# EAGLE design shutter (EAGLE 7.5.0)
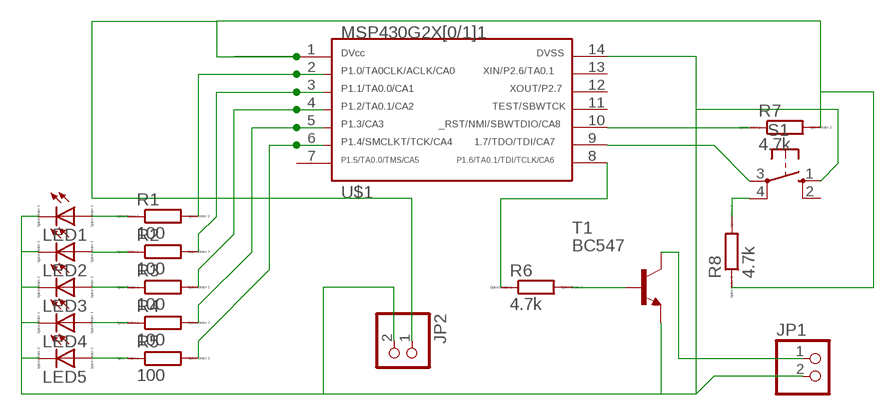
[diagram p0: schematic, sheet 1]

## Parts
JP1  PINHD-1X2  [1X02]
JP2  PINHD-1X2  [1X02]
LED1  LED_ESML0603  [LED_SML0603]
LED2  LED_ESML0603  [LED_SML0603]
LED3  LED_ESML0603  [LED_SML0603]
LED4  LED_ESML0603  [LED_SML0603]
LED5  LED_ESML0603  [LED_SML0603]
R1  100  RR0603  [R0603]
R2  100  RR0603  [R0603]
R3  100  RR0603  [R0603]
R4  100  RR0603  [R0603]
R5  100  RR0603  [R0603]
R6  4.7k  RR0603  [R0603]
R7  4.7k  RR0603  [R0603]
R8  4.7k  RR0603  [R0603]
S1  10-XX  [B3F-10XX]
T1  BC547  [TO92]
U$1  G2X[0/1]1---PW14  [PW14]

## Nets
GND: JP1.2 JP2.2 LED1.C LED2.C LED3.C LED4.C LED5.C S1.1(S) T1.1(E) U$1.14
N$2: R7.1 U$1.10
N$3: JP2.1 R7.2 R8.1 U$1.1
N$4: R6.2 T1.2(B)
N$5: LED1.A R1.1
N$6: LED2.A R2.1
N$7: LED3.A R3.1
N$8: LED4.A R4.1
N$9: LED5.A R5.1
N$10: R1.2 U$1.2
N$11: R2.2 U$1.3
N$12: R3.2 U$1.4
N$13: R4.2 U$1.5
N$14: R5.2 U$1.6
N$15: R6.1 U$1.8
N$16: S1.3(P) U$1.9
N$17: R8.2 S1.4(P1)
N$20: JP1.1 T1.3(C)
Unconnected: S1.2(S1) U$1.7 U$1.11 U$1.12 U$1.13

## Library data of the parts
JP1 JP2 = pinhead:PINHD-1X2: PIN HEADER
LED1-LED5 = eagle-ltspice:LED_E: LED Source: http://www.osram.convergy.de Source: www.luxeon.com Source: www.kingbright.com; SPICEMODEL: NONE; SPICEPREFIX: D; SPICETYPE: diode
R1-R8 = eagle-ltspice:R: RESISTOR, European symbol; SPICEMODEL: NONE; SPICEPREFIX: R
S1 = switch-omron:10-XX: OMRON SWITCH; MPN: B3F-1000; OC_FARNELL: 176432; OC_NEWARK: 36M3542
T1 = transistor:BC547: NPN TRANSISTOR
U$1 = TI_MSP430_v16:G2X[0/1]1---PW14: MSP430G2X[0/1]1 MSP430G2001, MSP430G2101, MSP430G2201,MSP430G2111, G2211 TSSOP (PW) 14 Pin Package http://focus.ti.com/docs/prod/folders/print/msp430g2111.html

## Board
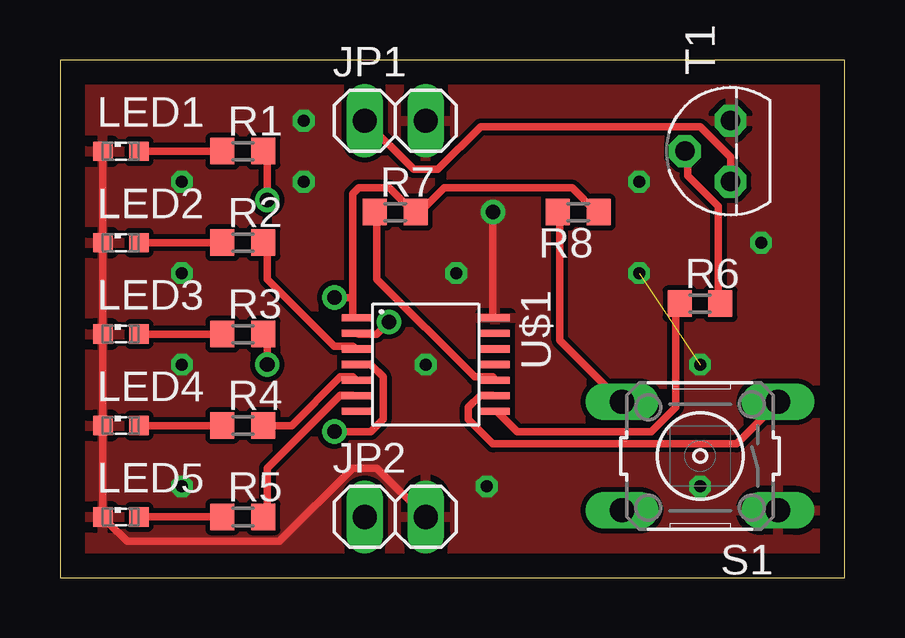
[diagram p1: board, top side]
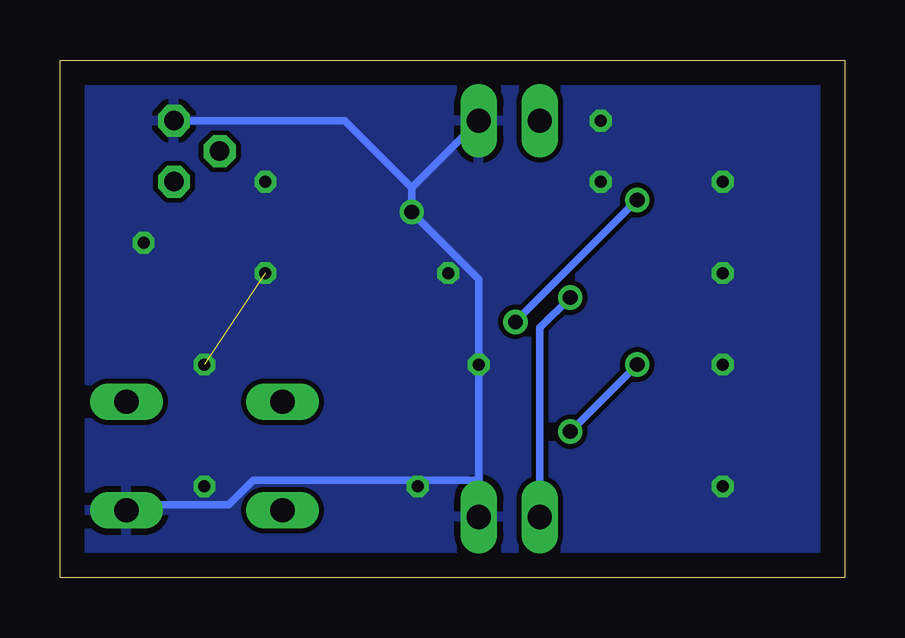
[diagram p2: board, bottom side, seen from below]

Size 32.69 x 21.58 mm. Coordinates in mm from the lower left corner, seen from the top.
Outline: 0,0 32.69,0 32.69,21.58 0,21.58 0,0
Copper layers (1*16): Top 0.035mm / dielectric 1.5mm / Bottom 0.035mm
Design rules "default *": minimum track width 12mil, minimum drill 24mil, track to track 8mil, track to pad 8mil, pad to pad 8mil, via to via 8mil, smd to smd 8mil, copper to edge 40mil, drill to drill 8mil, minimum pad ring 10mil, minimum via ring 8mil, stop-mask expansion 4mil, vias tented up to drill 0mil, thermal gap 10mil

### Footprints (pad centres in the part's own frame; a part is rotated, then mirrored left to right if it is on the bottom)
1X02 = drill 1.016 long: 1 -1.27,0; 2 1.27,0
LED_SML0603 = smd 0.8 x 0.8: A 0.75,0; C -0.75,0
R0603 = smd 1 x 1.1: 1 -0.85,0; 2 0.85,0
B3F-10XX = drill 1.016 long: 1 -3.251,2.261; 2 3.251,2.261; 3 -3.251,-2.261; 4 3.251,-2.261
TO92 = drill 0.813 octagon: 1 1.27,0; 2 0,1.905; 3 -1.27,0
PW14 = smd 0.3 x 1.2: 1 -1.95,-2.9; 2 -1.3,-2.9; 3 -0.65,-2.9; 4 0,-2.9; 5 0.65,-2.9; 6 1.3,-2.9; 7 1.95,-2.9; 8 1.95,2.9; 9 1.3,2.9; 10 0.65,2.9; 11 0,2.9; 12 -0.65,2.9; 13 -1.3,2.9; 14 -1.95,2.9

### Placement (x,y rotation side)
JP1  13.97,19.05 0 top
JP2  13.97,2.54 0 top
LED1  2.54,17.78 0 top
LED2  2.54,13.97 0 top
LED3  2.54,10.16 0 top
LED4  2.54,6.35 0 top
LED5  2.54,2.54 0 top
R1  7.62,17.78 0 top
R2  7.62,13.97 0 top
R3  7.62,10.16 0 top
R4  7.62,6.35 0 top
R5  7.62,2.54 0 top
R6  26.67,11.43 0 top
R7  13.97,15.24 0 top
R8  21.59,15.24 180 top
S1  26.67,5.08 180 top
T1  27.94,17.78 90 top
U$1  15.24,8.89 270 top

### Tracks (layer width: path | path; a pad name or v marks a point on that pad's centre or on a via)
GND  (via drill 0.5 pad 0.3, 0.61)  (1 unrouted)
  Top 0.305: 1.78,6.35 1.78,2.54 LED5.C 2.03,2.54 2.03,2.29 2.79,1.52 9.14,1.52 12.19,4.57 13.21,4.57 JP2.2 | 1.78,13.97 1.78,10.16 | 1.78,13.97 1.78,17.78 LED1.C | 1.78,13.97 LED2.C | 1.78,10.16 1.78,6.35 | 1.78,6.35 LED4.C | 1.78,10.16 LED3.C | v18.03,15.24 18.03,10.92 U$1.14
  Bottom 0.305: 18.03,16.26 v18.03,15.24 15.24,12.45 v15.24,8.89 15.24,4.06 | JP1.2 18.03,16.26 | T1.1 20.83,19.05 18.03,16.26 | 15.24,4.06 JP2.2 | 15.24,4.06 24.64,4.06 25.65,3.05 29.72,3.05 S1.1
  other vias: 24.13,16.51 5.08,16.51 5.08,12.7 5.08,8.89 5.08,3.81 10.16,16.51 10.16,19.05 16.51,12.7 24.13,12.7 29.21,13.97 17.78,3.81 26.67,3.81 26.67,8.89
  pour Bottom: 1.27,21.59 0,20.32 0,1.27 1.27,0 31.75,0 33.02,1.27 33.02,20.32 31.75,21.59
  pour Top: 1.27,21.59 0,20.32 0,1.27 1.27,0 31.75,0 33.02,1.27 33.02,20.32 31.75,21.59
N$2
  Top 0.305: R7.1 13.21,15.24 13.21,12.45 17.27,8.38 18.03,8.38 U$1.10
N$3  (via drill 0.61)
  Top 0.305: 12.19,11.68 12.19,10.92 U$1.1 | 12.19,11.68 12.19,16 12.45,16.26 13.72,16.26 14.73,15.24 R7.2 14.99,15.24 16,16.26 21.34,16.26 22.35,15.24 R8.1 | 12.19,11.68 v11.43,11.68
  Bottom 0.305: JP2.1 12.7,10.41 v11.43,11.68
N$4
  Top 0.305: R6.2 27.43,11.43 27.43,15.49 26.16,16.76 26.16,17.78 T1.2
N$5
  Top 0.305: R1.1 LED1.A
N$6
  Top 0.305: R2.1 LED2.A
N$7
  Top 0.305: R3.1 LED3.A
N$8
  Top 0.305: R4.1 LED4.A
N$9
  Top 0.305: R5.1 LED5.A
N$10  (via drill 0.61)
  Top 0.305: v8.64,15.75 8.64,17.78 R1.2 | v13.72,10.67 13.21,10.16 12.45,10.16 U$1.2
  Bottom 0.305: v13.72,10.67 v8.64,15.75
N$11
  Top 0.305: R2.2 8.64,13.97 8.64,12.45 11.43,9.65 12.19,9.65 U$1.3
N$12  (via drill 0.61)
  Top 0.305: v8.64,8.89 8.64,10.16 R3.2 | v11.43,6.1 12.95,6.1 13.46,6.6 13.46,8.38 12.95,8.89 U$1.4
  Bottom 0.305: v11.43,6.1 v8.64,8.89
N$13
  Top 0.305: R4.2 9.65,6.35 11.68,8.38 12.19,8.38 U$1.5
N$14
  Top 0.305: R5.2 8.64,2.54 8.64,4.57 11.68,7.62 12.19,7.62 U$1.6
N$15
  Top 0.305: R6.1 25.65,11.43 25.65,7.11 24.64,6.1 19.05,6.1 18.29,6.86 U$1.8
N$16
  Top 0.305: U$1.9 18.03,7.62 17.53,7.62 17.02,7.11 17.02,6.6 18.03,5.59 28.19,5.59 29.72,7.11 S1.3
N$17
  Top 0.305: R8.2 20.83,15.24 20.83,9.91 23.37,7.37 S1.4
N$20
  Top 0.305: T1.3 27.94,17.53 26.67,18.8 17.53,18.8 15.75,17.02 14.73,17.02 JP1.1